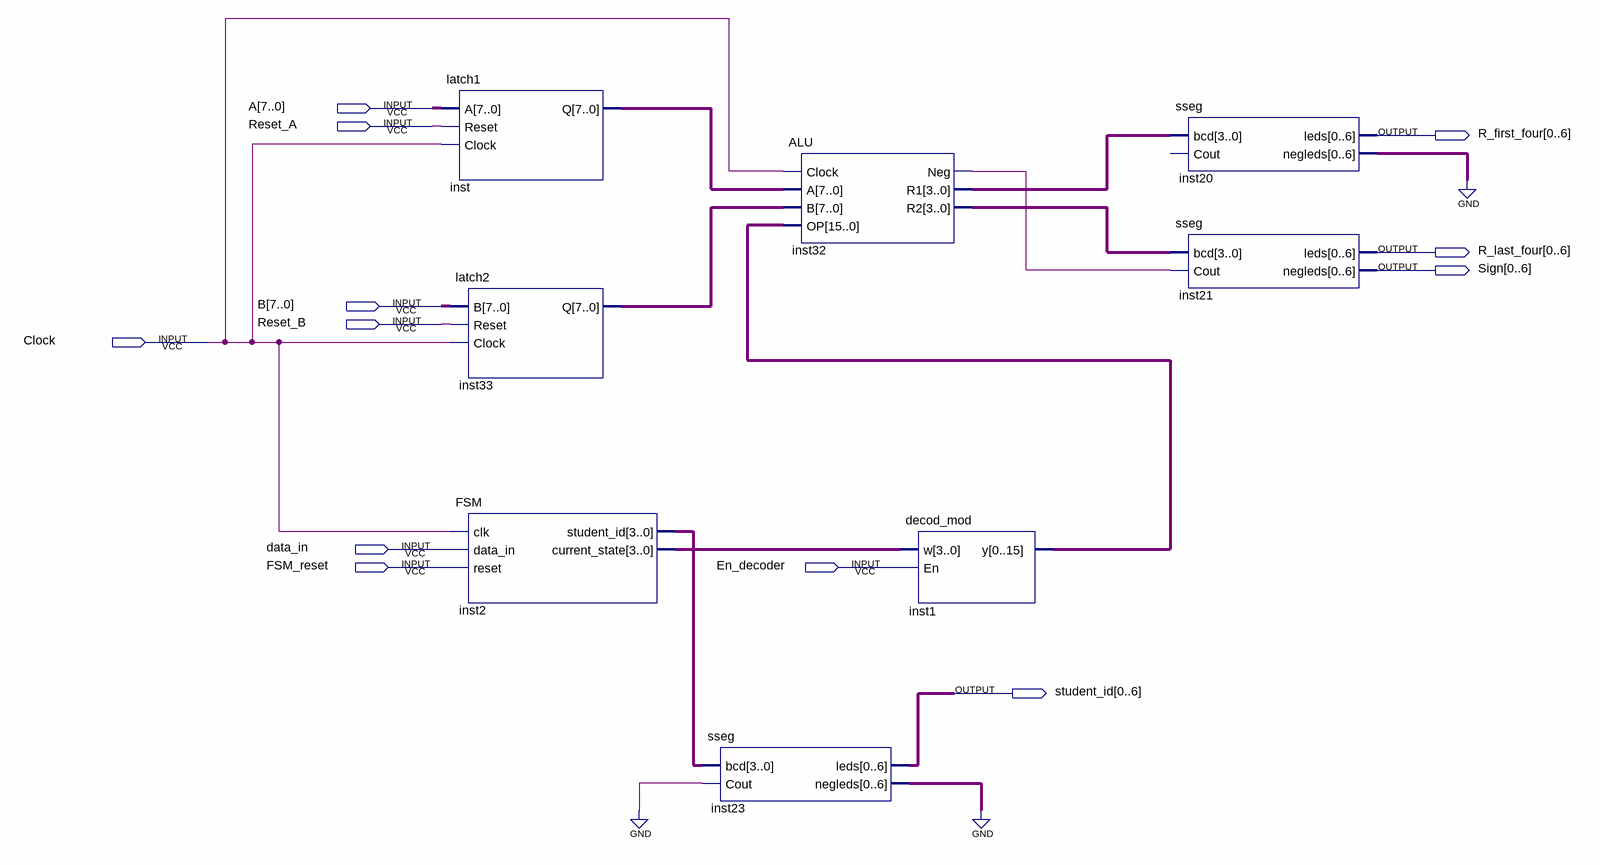
[diagram p0: schematic sheet]
// Quartus schematic GPU.bdf as structural Verilog: 8 symbols, 12 pins
module GPU (
  input  [7:0] A,
  input  Reset_A,
  input  [7:0] B,
  input  Reset_B,
  input  Clock,
  input  data_in,
  input  FSM_reset,
  input  En_decoder,
  output [0:6] R_first_four,
  output [0:6] R_last_four,
  output [0:6] Sign,
  output [0:6] student_id
);

  wire inst32_neg;
  wire [3:0] inst2_current_state, inst2_student_id, inst32_r1, inst32_r2;
  wire [6:0] inst20_negleds, inst23_negleds;
  wire [7:0] inst33_q, inst_q;
  wire [15:0] inst1_y;

  latch1 inst (.A(A), .Reset(Reset_A), .Clock(Clock), .Q(inst_q));
  latch2 inst33 (.B(B), .Reset(Reset_B), .Clock(Clock), .Q(inst33_q));
  FSM inst2 (
    .clk(Clock), .data_in(data_in), .reset(FSM_reset), .student_id(inst2_student_id),
    .current_state(inst2_current_state));
  sseg inst23 (.bcd(inst2_student_id), .Cout(1'b0), .leds(student_id), .negleds(inst23_negleds));
  ALU inst32 (.Clock(Clock), .A(inst_q), .B(inst33_q), .OP(inst1_y), .Neg(inst32_neg), .R1(inst32_r1), .R2(inst32_r2));
  decod_mod inst1 (.w(inst2_current_state), .En(En_decoder), .y(inst1_y));
  sseg inst20 (.bcd(inst32_r1), .leds(R_first_four), .negleds(inst20_negleds));  // open: Cout
  sseg inst21 (.bcd(inst32_r2), .Cout(inst32_neg), .leds(R_last_four), .negleds(Sign));
  // also tied to GND on the sheet: {inst20_negleds[0], inst20_negleds[1], inst20_negleds[2], inst20_negleds[3], inst20_negleds[4], inst20_negleds[5], inst20_negleds[6], inst23_negleds[0], inst23_negleds[1], inst23_negleds[2], inst23_negleds[3], inst23_negleds[4], inst23_negleds[5], inst23_negleds[6]}
endmodule
